# Altium schematic sheet SH3 - USB.SchDoc: USB
size B; Engineer: Tibi Andronescu; Revision: 1; SheetNumber: 3; SheetTotal: 4
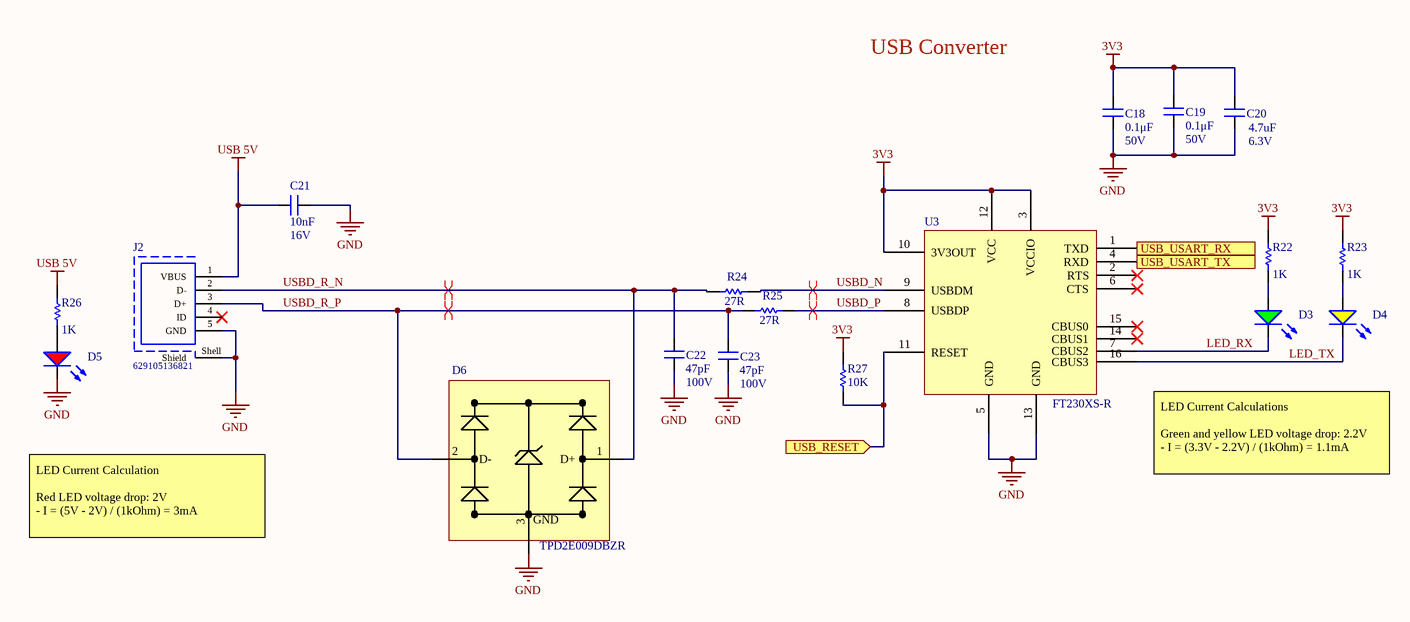
[diagram p0: SH3 - USB.SchDoc]

## Parts
C18  value 0.1μF  Voltage Rating: 50V  [CAP2012]  (hidden comment: CAP_0.1uF_50V_0805)
C19  value 0.1μF  Voltage Rating: 50V  [CAP2012]  (hidden comment: CAP_0.1uF_50V_0805)
C20  value 4.7uF  Voltage Rating: 6.3V  [CAPC0603(1608)55_N]  (hidden comment: CAP_4.7uF_0603)
C21  value 10nF  Voltage Rating: 16V  [CAP0603]  (hidden comment: CAP_10nF_0603)
C22  value 47pF  Voltage Rating: 100V  [CAP0603]  (hidden comment: CAP_47pF_100V_0603)
C23  value 47pF  Voltage Rating: 100V  [CAP0603]  (hidden comment: CAP_47pF_100V_0603)
D3  LG R971-KN-1  [LED_0805_GREEN]  (value not drawn)
D4  LY R976-PS-36  [LED_0805_YELLOW]  (value not drawn)
D5  LS R976-NR-1  [LED_0805_RED]  (value not drawn)
D6  Manufacturer Part Number: TPD2E009DBZR  [SOT23-3]  (hidden comment: TVS_DIODE_USB_5.5V)
J2  629105136821  [629105136821]
R22  value 1K  [RESC0603(1608)_N]  (hidden comment: RES_1K_0603)
R23  value 1K  [RESC0603(1608)_N]  (hidden comment: RES_1K_0603)
R24  Resistance: 27R  [RESC0603(1608)_N]  (hidden comment: RES_27R_0603)
R25  Resistance: 27R  [RESC0603(1608)_N]  (hidden comment: RES_27R_0603)
R26  value 1K  [RESC0603(1608)_N]  (hidden comment: RES_1K_0603)
R27  value 10K  [RESC0603(1608)_N]  (hidden comment: RES_10K_0603)
U3  Manufacturer Part Number 1: FT230XS-R  [SSOP16-0.635-5X4MM]  (hidden comment: IC_USB_TRANSCEIVER)

## Ports
USB_RESET (in), USB_USART_RX (out), USB_USART_TX (in)

## Nets
3V3: C18.2 C19.2 C20.1 R22.2 R23.2 R27.2 U3.3(VCCIO) U3.10(3V3OUT) U3.12(VCC)
GND: C18.1 C19.1 C20.2 C21.2 C22.1 C23.2 D5.2(K) D6.3(GND) J2.5(GND) J2.Shell(Shield) U3.5(GND) U3.13(GND)
USB 5V: C21.1 J2.1(VBUS) R26.2
LED_RX: D3.2(K) U3.7(CBUS2)
LED_TX: D4.2(K) U3.16(CBUS3)
USB_RESET: R27.1 U3.11(RESET) ; port USB_RESET
USB_USART_RX: U3.1(TXD) ; port USB_USART_RX
USB_USART_TX: U3.4(RXD) ; port USB_USART_TX
USBD_N: R24.2 U3.9(USBDM)
USBD_P: R25.2 U3.8(USBDP)
USBD_R_N: C22.2 D6.1(D+) J2.2(D-) R24.1
USBD_R_P: C23.1 D6.2(D-) J2.3(D+) R25.1
NetD3_1: D3.1(A) R22.1
NetD4_1: D4.1(A) R23.1
NetD5_1: D5.1(A) R26.1

Not connected (* = marked no-connect by the designer): J2 4(ID)*; U3 2(RTS)* 6(CTS)* 14(CBUS1)* 15(CBUS0)*

## Layout directives
differential pair: USBD_N, USBD_P, USBD_R_N, USBD_R_P

## Notes on the sheet
- USB Converter
- LED Current Calculations
  Green and yellow LED voltage drop: 2.2V
  - I = (3.3V - 2.2V) / (1kOhm) = 1.1mA
- LED Current Calculation
  Red LED voltage drop: 2V
  - I = (5V - 2V) / (1kOhm) = 3mA
- Title:
- Project:
- Date:
- Rev:
- Reviewer:
- Engineer:
- Sheet:
- of

## Library data of the parts
C18 C19 = CAP_0.1uF_50V_0805: CAP CER 0.1UF 50V X7R 0805; Manufacturer 1: Murata Electronics; Manufacturer Part Number 1: GCD21BR71H104KA01L; Tolerance: 10%; Mount: Surface Mount; Case Code (Metric): 2012; Case Code (Imperial): 0805; Min Operating Temperature: -55°C; Max Operating Temperature: 125°C; Dielectric: X7R; Termination: SMD/SMT; Length: 2mm; Height: 1.25mm; Width: 0.049inch; Thickness: 0.049inch; Depth: 1.25mm; Ratings: AEC-Q200; Supplier 1: Digi-Key; Supplier Part Number 1: 490-11955-1-ND; Package: 0805 (2012 Metric)
C20 = CAP_4.7uF_0603: CAP CER 4.7UF 6.3V X5R 0603; Manufacturer Part Number 1: CC0603KRX5R5BB475; Manufacturer 1: Yageo; Dimensions: 0.063" L x 0.031" W (1.60mm x 0.80mm); Package: 0603 (1608 Metric); Temperature Coefficient: X5R; Supplier Part Number 1: 311-1521-1-ND; Supplier 1: Digi-Key; Mount: Surface Mount
C21 = CAP_10nF_0603: CAP CER 10000PF 16V X7R 0603; Manufacturer Part Number 1: CC0603KRX7R7BB103; Manufacturer 1: Yageo; Supplier Part Number 1: 311-3369-1-ND; Supplier 1: Digi-Key; Mount: Surface Mount; Case Code (Imperial): 0603; Dielectric: X7R
C22 C23 = CAP_47pF_100V_0603: CAP CER 47PF 100V C0G/NP0 0603; Manufacturer Part Number 1: C0603C470J1GACTU; Manufacturer 1: KEMET; Temperature Coefficient: C0G; Dielectric: C0G, NP0; Dimensions: 0.063" L x 0.031" W (1.60mm x 0.80mm); Package: 0603 (1608 Metric); Supplier Part Number 1: 399-7917-1-ND; Supplier 1: Digi-Key; Mount: Surface Mount; Case Code (Imperial): 0603; Case Code (Metric): 1608
D3 = DIO_LED_G: LED GREEN DIFFUSED 0805 SMD; Manufacturer 1: OSRAM; Forward Voltage Drop: 2.2V; Package: 0805 (2012 Metric); Manufacturer Part Number 1: LG R971-KN-1; Supplier Part Number 1: 475-1410-1-ND; Supplier 1: Digi-Key; Mount: Surface Mount
D4 = DIO_LED_Y: LED YELLOW DIFFUSED 0805 SMD; Manufacturer 1: OSRAM; Forward Voltage Drop: 2.2V; Package: 0805 (2012 Metric); Manufacturer Part Number 1: LY R976-PS-36; Supplier Part Number 1: 475-2560-1-ND; Supplier 1: Digi-Key; Mount: Surface Mount
D5 = DIO_LED_R: LED RED DIFFUSED 0805 SMD; Manufacturer 1: OSRAM; Forward Voltage Drop: 2V; Package: 0805 (2012 Metric); Manufacturer Part Number 1: LS R976-NR-1; Supplier Part Number 1: 475-1278-1-ND; Supplier 1: Digi-Key; Mount: Surface Mount
D6 = TVS_DIODE_USB_5.5V: TVS DIODE 5.5V 8V SOT23-3; Manufacturer: Texas Instruments; Direction: Unidirectional; Operating Supply Voltage: 6V; Capacitance: 0.9pF; Number of Channels: 2; Current Rating: 100nA; Peak Pulse Current: 1A; Element Configuration: Dual; Min Breakdown Voltage: 9V; Peak Pulse Power: 45W; Power Line Protection: Yes; Breakdown Voltage: 7V; Interface: LVDS,PCIe,SATA; Supplier 1: Digi-Key; Category: Interface ICs; Case/Package: SOT-23; Number of Pins: 3; Min Operating Temperature: -40°C; Max Operating Temperature: 85°C; Number of Bidirectional Channels: 2; Reverse Standoff Voltage: 5.5V; Clamping Voltage: 8V; Termination: SMD/SMT; Max Power Dissipation: 45W; Working Voltage: 5.5V; Length: 2.92mm; Height: 1mm; Width: 1.3mm; Depth: 1.3mm; REACH SVHC: No SVHC; Supplier Part Number 1: 296-24657-1-ND
J2 = WE 629105136821: CONN RCPT USB2.0 MICRO B SMD R/A; Manufacturer: Wurth Elektronik; Contact Resistance: 30mOhm; Rated Current: 1A; Working Voltage: 30VAC; Connector Type: MicroUSB2.0TypeB; Gender: Receptacle; Datasheet URL: https://katalog.we-online.de/em/datasheet/629105136821.pdf; Mounting Technology: SMT; Publisher: WurthElektronik; Package Reference: 629105136821; Orientation: Horizontal; Part Number: 629105136821; Manufacturer URL: http://www.we-online.de; Operating Temperature: -40to105degC
R22 R23 R26 = RES_1K_0603: RES SMD 1K OHM 5% 1/10W 0603; Manufacturer 1: Yageo; Manufacturer Part Number 1: RC0603JR-071KL; Dimensions: 0.063" L x 0.031" W (1.60mm x 0.80mm); Tolerance: 5%; Package: 0603 (1608 Metric); Supplier Part Number 1: 311-1.0KGRCT-ND; Supplier 1: Digi-Key; Mount: Surface Mount
R24 R25 = RES_27R_0603: RES SMD 27 OHM 5% 1/10W 0603; Manufacturer: Yageo; Manufacturer Part Number: RC0603JR-0727RL; Voltage Rating (DC): 50V; Power Rating: 100mW; Temperature Coefficient: 100ppm/°C; Supplier 1: Digi-Key; RoHS: Yes; Category: Chip SMD Resistors; Stock 1: 2055343; Pricing 1: 1=0.10000, 10=0.01900, 100=0.00770, 1000=0.00347, 2500=0.00301 (USD); Case/Package: 0603; Number of Pins: 2; Case Code (Imperial): 0603; Case Code (Metric): 1608; Min Operating Temperature: -55°C; Max Operating Temperature: 155°C; Tolerance: 5%; Voltage Rating: 50V; Packaging: Tape and Reel; Termination: SMD/SMT; Composition: Thick Film; Military Standard: Not; Length: 1.6mm; Width: 0.8mm; Depth: 0.8mm; Lead Free: Lead Free; REACH SVHC: No SVHC; ComponentLink1URL: https://datasheet.ciiva.com/7746/443971-7746479.pdf?src-supplier=Element14; ComponentLink1Description: https://datasheet.ciiva.com/7746/443971-7746479.pdf?src-supplier=Element14; Supplier Part Number 1: 311-27GRCT-ND
R27 = RES_10K_0603: RES SMD 10K OHM 5% 1/10W 0603; Manufacturer 1: Yageo; Manufacturer Part Number 1: RC0603JR-0710KL; Package: 0603 (1608 Metric); Dimensions: 0.063" L x 0.031" W (1.60mm x 0.80mm); Tolerance: 5%; Supplier Part Number 1: 311-10KGRCT-ND; Supplier 1: Digi-Key; Mount: Surface Mount
U3 = IC_USB_TRANSCEIVER: IC USB SERIAL BASIC UART 16SSOP; Manufacturer 1: FTDI, Future Technology Devices International Ltd; Supplier 1: Digi-Key; Supplier Part Number 1: 768-1135-1-ND